# Altium schematic sheet 1_P1.schdoc.schdoc
size 309 x 223 mm; Symbol: Sheet-Symbol_A4; Device: Sheet-Symbol_A4; @Project Name: Battery Tree V2; @Page Count: 1; @Update Date: 2024-08-14; @Create Date: 2024-08-14; @Schematic Name: Schematic1; @Page No: 1; @Page Name: P1; Company: EasyEDA.com; Reviewed: EasyEDA; Version: V0.1; Page Size: A4; Part Number: JLCPCB-002; Drawn: EasyEDA
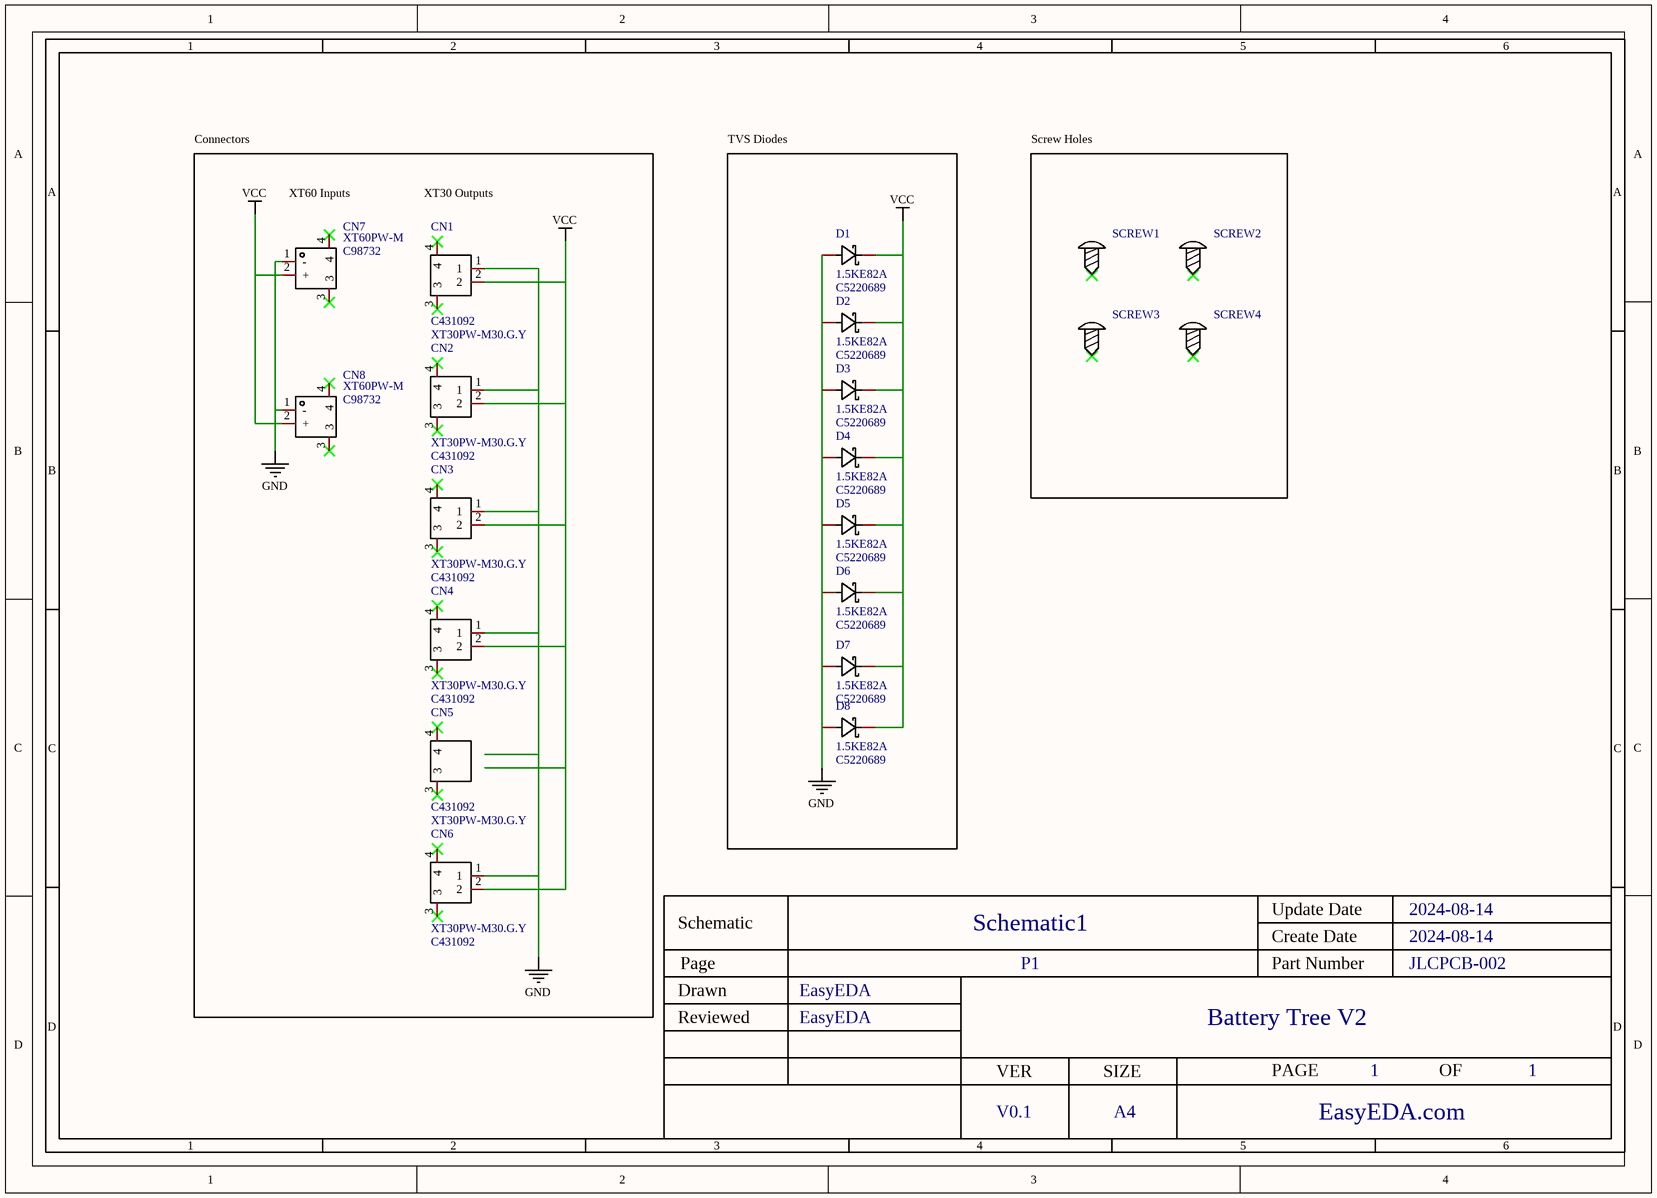
[diagram p0: 1_P1.schdoc.schdoc]

## Parts
CN1  Supplier Part: C431092  [CONN-TH_XT30PW-M]  (hidden comment: XT30PW-M30.G.Y)
CN2  Supplier Part: C431092  [CONN-TH_XT30PW-M]  (hidden comment: XT30PW-M30.G.Y)
CN3  Supplier Part: C431092  [CONN-TH_XT30PW-M]  (hidden comment: XT30PW-M30.G.Y)
CN4  Supplier Part: C431092  [CONN-TH_XT30PW-M]  (hidden comment: XT30PW-M30.G.Y)
CN5  Supplier Part: C431092  [CONN-TH_XT30PW-M]  (hidden comment: XT30PW-M30.G.Y)
CN6  Supplier Part: C431092  [CONN-TH_XT30PW-M]  (hidden comment: XT30PW-M30.G.Y)
CN7  Supplier Part: C98732  [CONN-TH_XT60PW-M]  (hidden comment: XT60PW-M)
CN8  Supplier Part: C98732  [CONN-TH_XT60PW-M]  (hidden comment: XT60PW-M)
D1  Supplier Part: C5220689  [DIO-TH_BD5.1-L8.4-P12.40-D1.0-RD]  (hidden comment: 1.5KE82A)
D2  Supplier Part: C5220689  [DIO-TH_BD5.1-L8.4-P12.40-D1.0-RD]  (hidden comment: 1.5KE82A)
D3  Supplier Part: C5220689  [DIO-TH_BD5.1-L8.4-P12.40-D1.0-RD]  (hidden comment: 1.5KE82A)
D4  Supplier Part: C5220689  [DIO-TH_BD5.1-L8.4-P12.40-D1.0-RD]  (hidden comment: 1.5KE82A)
D5  Supplier Part: C5220689  [DIO-TH_BD5.1-L8.4-P12.40-D1.0-RD]  (hidden comment: 1.5KE82A)
D6  Supplier Part: C5220689  [DIO-TH_BD5.1-L8.4-P12.40-D1.0-RD]  (hidden comment: 1.5KE82A)
D7  Supplier Part: C5220689  [DIO-TH_BD5.1-L8.4-P12.40-D1.0-RD]  (hidden comment: 1.5KE82A)
D8  Supplier Part: C5220689  [DIO-TH_BD5.1-L8.4-P12.40-D1.0-RD]  (hidden comment: 1.5KE82A)
SCREW1  Screw-Hole-M3  [Screw-Hole-M3]  (value not drawn)
SCREW2  Screw-Hole-M3  [Screw-Hole-M3]  (value not drawn)
SCREW3  Screw-Hole-M3  [Screw-Hole-M3]  (value not drawn)
SCREW4  Screw-Hole-M3  [Screw-Hole-M3]  (value not drawn)

## Blocks framed on the sheet
TVS Diodes: D1-D8
Screw Holes: SCREW1-SCREW4

## Nets
GND: CN1.1 CN2.1 CN3.1 CN4.1 CN6.1 CN7.1(-) CN8.1(-) D1.2(K) D2.2(K) D3.2(K) D4.2(K) D5.2(K) D6.2(K) D7.2(K) D8.2(K)
VCC: CN1.2 CN2.2 CN3.2 CN4.2 CN6.2 CN7.2(+) CN8.2(+) D1.1(A) D2.1(A) D3.1(A) D4.1(A) D5.1(A) D6.1(A) D7.1(A) D8.1(A)

Not connected (* = marked no-connect by the designer): CN1 3* 4*; CN2 3* 4*; CN3 3* 4*; CN4 3* 4*; CN5 1 2 3* 4*; CN6 3* 4*; CN7 3* 4*; CN8 3* 4*; SCREW1 1*; SCREW2 1*; SCREW3 1*; SCREW4 1*

## Notes on the sheet
- Connectors
- (near CN7) XT60 Inputs
- XT30 Outputs
- 1
- 2
- 3
- 4
- 5
- 6
- A
- B
- C
- Schematic
- Schematic1
- Create Date
- Update Date
- 2024-08-14
- Reviewed
- Drawn
- Page
- EasyEDA
- P1
- Part Number
- Battery Tree V2
- JLCPCB-002
- D
- VER
- SIZE
- PAGE
- OF
- V0.1
- A4
- EasyEDA.com

## Library data of the parts
CN1-CN6 = XT30PW-M30.G.Y: Manufacturer: AMASS(艾迈斯); Add into BOM: yes; RatedVoltage: DC 500V; InterfaceType: Male head; RatedCurrent: 15A; RecommendedWireGauge: 16/18/20AWG; contact resistance: 1.2mΩ; specifications: 2pin; Description: Power:- Output:- Input:- Size:- Interface:- Type:- Colour:- MaximumCurrent:- Type:Aviation model plug RatedVoltage:DC 500V Type1:- NumberOfUSBHoles:- InterfaceType:Male head MetalMaterial:- InsulationMaterial:- RatedCurrent:15A RecommendedWireGauge:16/18/; Check: true; Name: XT30PW-M30.G.Y; Symbol: XT30PW-M; Device: XT30PW-M30.G.Y; LCSC Part Name: AMASS(艾迈斯)航模插头 卧式弯脚 XT30PW-M公头; Manufacturer Part: XT30PW-M30.G.Y; Supplier Footprint: -; JLCPCB Part Class: Extended Part; Datasheet: https://atta.szlcsc.com/upload/public/pdf/source/20220222/6A9F22F7850E25B33E1BE430ADF8560B.pdf; Supplier: LCSC; Convert to PCB: yes; Power: -; Output: -; Input: -; Size: -; Interface: -; Type: Aviation model plug; Colour: -; MaximumCurrent: -; Type1: -; NumberOfUSBHoles: -; MetalMaterial: -; InsulationMaterial: -; FlameRetardantGrade: -; Belt length: -
CN7 CN8 = XT60PW-M: Manufacturer: AMASS(艾迈斯); Add into BOM: yes; Brand: 艾迈斯; InterfaceType: 公头; Description: Brand:艾迈斯 Model:XT60PW-M Power:- Output:- Input:- Size:- Interface:- Type:- Colour:Yellow MaximumCurrent:- Type:卧式插头 RatedVoltage:- Type1:- NumberOfUSBHoles:- InterfaceType:公头 MetalMaterial:- InsulationMaterial:- RatedCurrent:- RecommendedWireGauge:- Flam; Check: true; Name: XT60PW-M; Symbol: XT60PW-M; Device: XT60PW-M; LCSC Part Name: AMASS(艾迈斯)航模插头xt60连接器150公母对接pw锂电池公头 板插卧式XT60PW-M; Manufacturer Part: XT60PW-M; Supplier Footprint: -; JLCPCB Part Class: Extended Part; Datasheet: https://atta.szlcsc.com/upload/public/pdf/source/20240118/44A3DCFF53BE25DC65378AFFB21277A4.pdf; Supplier: LCSC; Convert to PCB: yes; Model: XT60PW-M; Power: -; Output: -; Input: -; Size: -; Interface: -; Type: 卧式插头; Colour: Yellow; MaximumCurrent: -; RatedVoltage: -; Type1: -; NumberOfUSBHoles: -; MetalMaterial: -; InsulationMaterial: -; RatedCurrent: -; RecommendedWireGauge: -; FlameRetardantGrade: -; contact resistance: -; Belt length: -; specifications: -
D1-D8 = 1.5KE82AHE3_A/D: Manufacturer: Shenzhen Jinkaisheng Elec; Add into BOM: yes; Reverse Stand-Off Voltage (Vrwm): 70.1V; Maximum Clamping Voltage: 113V; Peak Pulse Current (Ipp)@10/1000us: 13.3A; Peak Pulse Power Dissipation (Ppp)@10/1000us: 1.5kW; Breakdown Voltage: 77.9V; Type: TVS; Description: Reverse Stand-Off Voltage (Vrwm):70.1V Maximum Clamping Voltage:113V Peak Pulse Current (Ipp)@10/1000us:13.3A Peak Pulse Power Dissipation (Ppp)@10/1000us:1.5kW Breakdown Voltage:77.9V Type:TVS; Check: true; Name: 1.5KE82A; Symbol: 1.5KE82AHE3_A/D; Device: 1.5KE82AHE3_A/D; LCSC Part Name: 1.5KE82AHE3_A/D; Manufacturer Part: 1.5KE82A; Supplier Footprint: DO-201AA(DO-27); JLCPCB Part Class: Extended Part; Datasheet: https://atta.szlcsc.com/upload/public/pdf/source/20210429/F15769E08F8AD9C0D8DF15E8B979D164.pdf; Supplier: LCSC; Convert to PCB: yes
SCREW1-SCREW4 = Screw-Hole-M3: Convert to PCB: yes; Add into BOM: no; Symbol: Screw-Hole; Device: Screw-Hole-M3; Supplier Footprint: 插件